# Altium schematic sheet DIOT_PSU_Mezzanine.SchDoc: DI/OT Crate
size 420 x 297 mm; Project: DI/OT Backplane - Front panel PCB; CheckedBy: G. Daniluk; Author: F. Świtakowski; CompanyName: Creotech Instruments SA; DrawnBy: F. Świtakowski; Organization: CERN; Address1: European Organization for Nuclear Research; Address2: CH-1211 Geneve 23 - Switzerland; DocumentNumber: 1; Revision: -; SheetNumber: 1; SheetTotal: 1; EDA_Number: EDA-04213-V3-0; Projet: DI/OT Crate; ModifiedBy: M. Fafara; CreateDate: 1.10.2019; CheckedDate: 10.11.2019; Title2: Front Interface; DivGrp: BE-CEM; Designer: F. Świtakowski; SPICEModelCacheTQWPXFHW: <root> / <DocumentId>TQWPXFHW</DocumentId> / </root>; DocumentName: AFPGA_power.SchDoc; ModifiedDate: -; Rule: PcbType=ProtelPcb
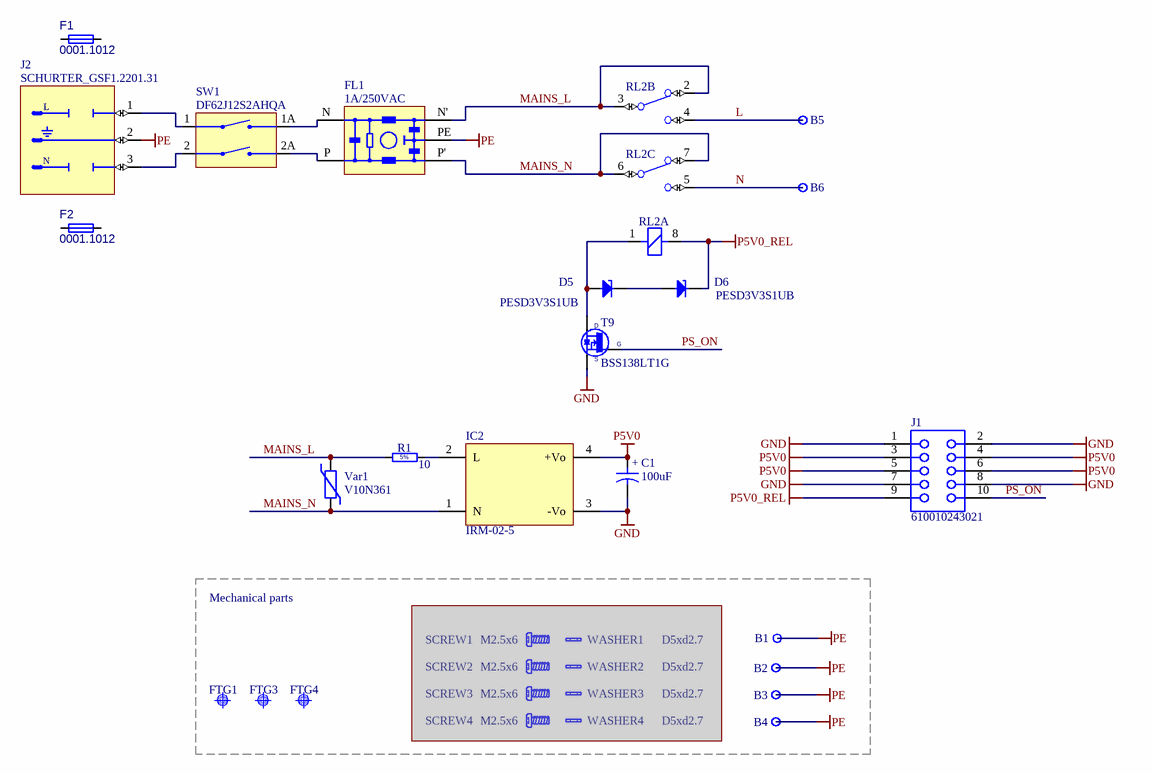
[diagram p0: DIOT_PSU_Mezzanine.SchDoc]

## Parts
B1  Plated Hole  [MTG320_550]  (value not drawn)  (no BOM)
B2  Plated Hole  [MTG320_550]  (value not drawn)  (no BOM)
B3  Plated Hole  [MTG320_550]  (value not drawn)  (no BOM)
B4  Plated Hole  [MTG320_550]  (value not drawn)  (no BOM)
B5  Plated Hole  [c350h200]  (value not drawn)  (no BOM)
B6  Plated Hole  [c350h200]  (value not drawn)  (no BOM)
C1  100uF  [CAPPR350-850X600]
D5  PESD3V3S1UB  [SODFL1608X65N]
D6  PESD3V3S1UB  [SODFL1608X65N]
F1  0001.1012  [0001.1012]
F2  0001.1012  [0001.1012]
FL1  1A/250VAC  [FIL_SCHAFFNER_FN 406]
FTG1  Use only in PCB  [FIDUCIAL_TOP_C100-200]  (value not drawn)  (no BOM)
FTG3  Use only in PCB  [FIDUCIAL_TOP_C100-200]  (value not drawn)  (no BOM)
FTG4  Use only in PCB  [FIDUCIAL_TOP_S100-200]  (value not drawn)  (no BOM)
IC2  IRM-02-5  [PWS_MEANWELL_IRM-02]
J1  610010243021  [610010243021]
J2  Part Number: SCHURTER_GSF1.2201.31  [SCHURTER_GSF1.2202.31]  (hidden comment: IEC)
R1  10  [RESADV508-1670X520]
RL2  REL_OMRON_G2RL-24  [REL_OMRON_G2RL-24]  (value not drawn)  (parts A,B,C of 3)
SCREW1  M2.5x6  [BOSSARD_BN5687-3061597_v]  (masked out: inside a compile mask, not in the netlist)
SCREW2  M2.5x6  [BOSSARD_BN5687-3061597_v]  (masked out: inside a compile mask, not in the netlist)
SCREW3  M2.5x6  [BOSSARD_BN5687-3061597_v]  (masked out: inside a compile mask, not in the netlist)
SCREW4  M2.5x6  [BOSSARD_BN5687-3061597_v]  (masked out: inside a compile mask, not in the netlist)
SW1  DF62J12S2AHQA  [DF62J12S2AHQA]
T9  BSS138LT1G  [SOT95P240X110-3N]
Var1  V10N361  [VARISTOR THT]
WASHER1  D5xd2.7  [BOSSARD_BN678-8303525_v]  (masked out: inside a compile mask, not in the netlist)
WASHER2  D5xd2.7  [BOSSARD_BN678-8303525_v]  (masked out: inside a compile mask, not in the netlist)
WASHER3  D5xd2.7  [BOSSARD_BN678-8303525_v]  (masked out: inside a compile mask, not in the netlist)
WASHER4  D5xd2.7  [BOSSARD_BN678-8303525_v]  (masked out: inside a compile mask, not in the netlist)

## Blocks framed on the sheet
Mechanical parts: B1-B4 FTG1 FTG3 FTG4 SCREW1-SCREW4 WASHER1-WASHER4

## Nets
GND: C1.2 IC2.3(-Vo) J1.1 J1.2 J1.7 J1.8 T9.2(S)
P5V0: C1.1 IC2.4(+Vo) J1.3 J1.4 J1.5 J1.6
P5V0_REL: D6.1(C) J1.9 RL2.8
PE: B1.1 B2.1 B3.1 B4.1 FL1.PE J2.2
L: B5.1 RL2.4(NO)
MAINS_L: FL1.N' R1.2 RL2.2(NC) RL2.3(C) Var1.2
MAINS_N: FL1.P' IC2.1(N) RL2.6(C) RL2.7(NC) Var1.1
N: B6.1 RL2.5(NO)
PS_ON: J1.10 T9.1(G)
NetD5_1: D5.1(C) D6.2(A)
NetD5_2: D5.2(A) RL2.1 T9.3(D)
NetFL1_N: FL1.N SW1.1A
NetFL1_P: FL1.P SW1.2A
NetIC2_2: IC2.2(L) R1.1
NetJ2_1: J2.1 SW1.1
NetJ2_3: J2.3 SW1.2

## Notes on the sheet
- Project/Equipment
- Document
- Designer
- Drawn by
- Check.by
- Copyright WUT ISE 2020.
  This documentation describes Open Hardware and is licensed under the CERN OHL v.1.2. You may redistribute and modify this documentation under the terms of the CERN OHL v.1.2. (http://ohwr.org/CERNOHL). This documentation is distributed WITHOUT ANY EXPRESS OR IMPLIED WARRANTY, INCLUDING OF MERCHANTABILITY, SATISFACTORY QUALITY AND FITNESS FOR A PARTICULAR PURPOSE. Please see the CERN OHL v.1.2 for applicable conditions.
- Contact
- File
- Last Mod.
- Print Date
- Sheet
- Size
- A3
- of
- Rev
- (in symbol CAER_100UF_10V_20%_350-850X600_LESR0R032) +
- (in symbol RMF_10R_5%_3W_250PPM_508-1670X520_v) 5%
- (in symbol SCHURTER_GSF1.2202.31) L; N

## Library data of the parts
B1-B4 = PLATED_HOLE3.2_PAD5.5: Single Terminal Socket; Part Description: Plated Through Hole: Hole Dia.=3.2mm Pad Dia.=5.5mm; Mounted: No; Part Number: PLATED_HOLE3.2_PAD5.5; Component Type: Standard (No BOM); Pin Count: 1; Family: Plated Hole; Socket: No; SMD: No; Sense: No; Status: None; ComponentHeight: 0mm; HelpURL: Undefined; Author: CERN DEM JMW; CreateDate: 01.10.2012; LatestRevisionDate: 01.10.2012; PackageDescription: Plated Through Hole: Hole Dia.=3.2mm Pad Dia.=5.5mm
B5 B6 = PLATED_HOLE2.0_PAD3.5: Single Terminal Socket; Part Description: Plated Through Hole: Hole Dia.=2.0mm Pad Dia.=3.5mm; Mounted: No; Part Number: PLATED_HOLE2.0_PAD3.5; Component Type: Standard (No BOM); Pin Count: 1; Family: Plated Hole; Socket: No; SMD: No; Sense: No; Status: None; ComponentHeight: 0mm; HelpURL: Undefined; Author: CERN DEM JMW; CreateDate: 05.11.2009; LatestRevisionDate: 05.11.2009; PackageDescription: Plated Through Hole: Hole Dia.=2.0mm Pad Dia.=3.5mm
C1 = CAER_100UF_10V_20%_350-850X600_LESR0R032: Polarised capacitor; Part Description: Low ESR 0R032 Aluminum Solid Capacitor with Organic Semiconductive Electrolyte; Manufacturer: SANYO OS-CON; Manufacturer Part Number: 10SP100M; Voltage: 10V; Tolerance: ±20%; Part Number: CAER_100UF_10V_20%_350-850X600_LESR0R032; Component Kind: Standard; Component Type: Standard; Pin Count: 2; Value: 100uF; Status: Obsolete; Case: LS3.5 D8.5 x H6; Mounted: Yes; Socket: No; SMD: No; Sense: No; ComponentHeight: 6mm; HelpURL: \\cern.ch\dfs\Applications\Altium\Datasheets\CAER-LESR_SANYO_SP.pdf; Author: CERN DEM JLC; CreateDate: 29.01.2008; LatestRevisionDate: 16.03.2009
D5 D6 = PESD3V3S1UB: ESD protection diode; Part Description: ESD protection diode (23kV); Manufacturer: NXP SEMICONDUCTORS; Voltage: 3V3; Power: 330W; PressFit: No; Bonding: No; Part Number: PESD3V3S1UB; Component Kind: Standard; Component Type: Standard; Device: PESD3V3S1UB; PackageDescription: Ultra Small Outline Diode Flat Lead (SOD-523), Body; 1.2mm L X 0.8mm W X 0.65mm H, IPC Medium Density; Manufacturer Part Number: PESD3V3S1UB; Pin Count: 2; Case: SOD523; Mounted: Yes; Socket: No; SMD: Yes; Sense: No; ComponentHeight: 0.65mm; HelpURL: \\cern.ch\dfs\Applications\Altium\Datasheets\PESD3V3S1UB.pdf; Author: CERN DEM JLC; CreateDate: 29.11.2012; LatestRevisionDate: 29.11.2012
F1 F2 = CMP-005-00401-1: Electric Fuse, Very Fast Blow, 6.3A, 250VAC, 1500A (IR), Inline/holder, 5x20mm; Mounting Technology: Holder; Current Rating: 6.3A; Max Operating Temperature: 125°C; Min Operating Temperature: -55°C; RoHS Compliant: Yes
FL1 = FIL_SCHAFFNER_FN 406-1-02: 0.6 to 8.4A 230VAC Single Phase Ultra Compact EMC Filter; Part Number: FIL_SCHAFFNER_FN406-3-02; Manufacturer Part Number: FN406-3-02; Component Kind: Standard; Component Type: Standard; Pin Count: 5; Value: 1A/250VAC; Part Description: Single Phase Ultra Compact EMC Filter; Manufacturer: SCHAFFNER; Case: L45 W15 H28; Mounted: Yes; Socket: No; SMD: No; Sense: No; ComponentHeight: 28mm; HelpURL: \\cern.ch\dfs\Applications\Altium\Datasheets\FIL_SCHAFFNER_FN 406-1-02.pdf; Author: CERN DEM JLC; CreateDate: 24.05.2017; LatestRevisionDate: 24.05.2017
FTG1 FTG3 = FIDUCIAL_TARGET_C100-200: Fiducial Target; Part Description: Round Fiducial Target, Top Layer, 1.0mm, Top Solder 2.0mm, Keepout =2.0mm; Mounted: No; Part Number: FIDUCIAL_TARGET_C100-200; Component Type: Standard (No BOM); Pin Count: 1; Family: Fiducial; Socket: No; SMD: Yes; Sense: No; Status: None; ComponentHeight: 0mm; HelpURL: Undefined; Author: CERN DEM JLC; CreateDate: 09.02.2010; LatestRevisionDate: 04.04.2012; PackageDescription: Round Fiducial Target, Top Layer, 1.0mm, Top Solder 2.0mm, Keepout =2.0mm
FTG4 = FIDUCIAL_TARGET_S100-200: Fiducial Target; Part Description: Square Fiducial Target, Top Layer, 1.0mm, Top Solder 2.0mm, Keepout =2.0mm; Mounted: No; Part Number: FIDUCIAL_TARGET_S100-200; Component Type: Standard (No BOM); Pin Count: 1; Family: Fiducial; Socket: No; SMD: Yes; Sense: No; Status: None; ComponentHeight: 0mm; HelpURL: Undefined; Author: CERN DEM JLC; CreateDate: 09.02.2010; LatestRevisionDate: 04.04.2012; PackageDescription: Square Fiducial Target, Top Layer, 1.0mm, Top Solder 2.0mm, Keepout =2.0mm
IC2 = AC_DC_IRM-02-5: Power Supply; Part Description: 85-305VAC to 5VDC (400mA) 2W Power Supply; Manufacturer: MEAN WELL; PressFit: No; Bonding: No; Part Number: IRM-02-5; Component Kind: Standard; Component Type: Standard; Device: IRM-02-5; PackageDescription: IRM-02 Series, Body 33.7x22.2mm, Power Supply; Status: None; Manufacturer Part Number: IRM-02-5; Pin Count: 4; Mounted: Yes; Socket: No; SMD: No; Sense: No; ComponentHeight: 15mm; HelpURL: \\cern.ch\dfs\Applications\Altium\Datasheets\IRM-02-24.pdf; Author: GK; CreateDate: 14.02.2018; LatestRevisionDate: 14.02.2018
J1 = 610010243021: WR-PHD Socket Header, SMT, Vertical, pitch 2.54mm, 2 Row, 10P; Manufacturer: Wurth Elektronik; Contact Resistance: 20mOhm; Rated Current: 3A; Working Voltage: 250V; Withstanding Voltage: 500V; Manufacturer Part Number: 610010243021; Category: Board-to-Board Connectors; Match Code: WR-PHD; ComponentLink1Description: Website Link; ComponentLink1URL: https://www.we-online.com/redexpert/article/610010243021?ad; ComponentLink2Description: Datasheet Link; ComponentLink2URL: https://www.we-online.com/redexpert/spec/610010243021?ad; Mount: Surface Mount; Operating Temperature Max: 125°C; Operating Temperature Min: -40°C; Packaging: Tube; Gender: Socket Header; Number of Pins: 10; Number of Rows: 2; Orientation: Vertical; Pitch: 2.54mm
J2 = SCHURTER_GSF1.2202.31: Connector 3 Male 2P+ 2 Fuse Holder; Part Description: 10A 250Vac Sandwich Panel Mount (1.5mm) Inlet IEC Connector With 2 Fuseholder 5x20mm And Snap-in PCB Mount; Manufacturer Part Number: GSF1.2201.31; PressFit: No; Component Kind: Standard; Component Type: Standard; Footprint: SCHURTER_GSF1.2201.31; Pin Count: 3; Family: IEC; Mounted: Yes; Socket: No; SMD: No; Sense: No; Status: None; Manufacturer: SCHURTER; ComponentHeight: 24.45mm; HelpURL: \\cern.ch\dfs\Applications\Altium\Datasheets\SCHURTER_GSF1.2202.31.pdf; Author: CERN DEM JMW; CreateDate: 20.09.2012; LatestRevisionDate: 20.09.2012
R1 = RMF_10R_5%_3W_250PPM_508-1670X520_v: Resistor - 5%; Part Description: Leaded Power Metal Film Resistor (Vertical Mount) PR03 Series; Manufacturer: GENERIC; Manufacturer1 Part Number: PR03000201009JAC00; Power: 3W; TC: ±250ppm/°C; PressFit: No; Part Number: RMF_10R_5%_3W_250PPM_508-1670X520_v; Component Kind: Standard; Component Type: Standard; Pin Count: 2; Value: 10; Status: Preferred; Tolerance: ±5%; Manufacturer Part Number: RMF_10R_5%_3W_250PPM_508-1670X520; Case: LS5.08 L16.7 x D5.2; Mounted: Yes; Sense: No; Socket: No; SMD: No; ComponentHeight: 23.6mm; Manufacturer1 Example: VISHAY BCCOMPONENT; Manufacturer1 ComponentHeight: 23.6mm; HelpURL: \\cern.ch\dfs\Applications\Altium\Datasheets\RMF_VISHAY_PR03.pdf; Author: CERN DEM JLC; CreateDate: 04.07.2017; LatestRevisionDate: 04.07.2017
RL2 = REL_OMRON_G2RL-24-DC5: DPDT Power Relay, G2RL Series; Part Description: 8A@250VAC, DPDT Power Relay, G2RL Series; Manufacturer: OMRON ELECTRONIC; PressFit: No; Sense Comment: Sensitive=No (Component Sealed); Value: 5VDC; Part Number: REL_OMRON_G2RL-24-DC5; Component Kind: Standard; Component Type: Standard; Pin Count: 8; PackageDescription: 8 Leads, Row Spacing 7.5mm; Body 29mm x 12.7mm, OMRON_G2RL Series; Mounted: Yes; Socket: No; SMD: No; Sense: No; Status: None; Manufacturer Part Number: G2RL-24-DC5; ComponentHeight: 15.7mm; HelpURL: \\cern.ch\dfs\Applications\Altium\Datasheets\REL_OMRON_G2RL-24.pdf; Author: CERN DEM BC; CreateDate: 11.09.2023; LatestRevisionDate: 11.09.2023
SCREW1-SCREW4 = BOSSARD_BN5687-3061597_v: Screw; Part Description: M2.5 L=6mm Hexalobular Socket Pan Head Screw, Fully Threaded, Stainless Steel A2; Manufacturer Part Number: BN5687 Art.3061597; PressFit: No; Part Number: BOSSARD_BN5687-3061597_v; Component Kind: Standard; Component Type: Mechanical; Pin Count: 0; PackageDescription: M2.5 L=6mm Hexalobular Socket Pan Head Screw, Fully Threaded - Stainless Steel A2; Mounted: Yes; Socket: No; SMD: No; Sense: No; Status: None; Value: M2.5x6; Manufacturer: BOSSARD; ComponentHeight: 2.1mm; HelpURL: \\cern.ch\dfs\Applications\Altium\Datasheets\BOSSARD_BN5687-3061597.pdf; Author: CERN DEM JLC; CreateDate: 30.05.2013; LatestRevisionDate: 30.05.2013
SW1 = DF62J12S2AHQA: Rocker Switch DPST 16A (AC), 6A (DC) 125 V Panel Mount, Snap-In, Right Angle; Manufacturer: C&K; Tolerance: ±1%; PressFit: No; Part Number: DF62J12S2AHQA; Component Kind: Standard; Component Type: Standard; Pin Count: 6; Status: None; Part Description: Rocker Switch DPST 16A (AC), 6A (DC) 125 V Panel Mount, Snap-In, Right Angle; Manufacturer Part Number: DF62J12S2AHQA; Mounted: Yes; Sense: No; Socket: No; SMD: No; ComponentHeight: 12mm; HelpURL: https://www.ckswitches.com/media/1443/df.pdf; Author: LPA; CreateDate: 9.03.2025; LatestRevisionDate: 9.03.2025
T9 = BSS138LT1G: N-CHANNEL MOSFET WITH DIODE; Part Description: 50V, 200mA N-Channel Enhancement Mode Field-Effect Transistor; Manufacturer: ON SEMICONDUCTOR; PressFit: No; Bonding: No; Part Number: BSS138LT1G; Component Kind: Standard; Component Type: Standard; Device: BSS138LT1G; PackageDescription: SOT23, 0.95mm Pitch; 3 Pin, 1.40mm W X 3.00mm L X 1.10mm H body, IPC Medium Density; Manufacturer Part Number: BSS138L; Pin Count: 3; Case: SOT23-3; Mounted: Yes; Socket: No; SMD: Yes; Sense: No; ComponentHeight: 1.11mm; HelpURL: \\cern.ch\dfs\Applications\Altium\Datasheets\BSS138LT1G.pdf; Author: CERN DEM JLC; CreateDate: 23.03.2009; LatestRevisionDate: 25.05.2022
Var1 = V10N361: Warystor fi10mm 360V; Manufacture: LS-TECH; DafaultFootprint: THT Varistor fi10mm; Assembly: THT; Parameter1: Umax; Parameter2: Imax; Value2: 3.6kA; Shop1: Maritex; Replacement1: ERZE10A361; ComponentLink1URL: https://www.maritex.com.pl/elementy_pasywne/warystory/warystory_tht/warystory_tht/v10n361.html; ComponentLink2URL: *; ComponentLink1Description: Datasheet; ComponentLink2Description: *; Value1: 360V; Shop1ID: V10N361; ComponentType: Varistor; ComponentSymbol: V10N361; Tolerance1: *
WASHER1-WASHER4 = BOSSARD_BN678-8303525_v: Washer; Part Description: Waved Spring Washer for M2.5 Screw, Stainless Steel A2 / 1.4310; Manufacturer Part Number: BN678 Art.8303525; PressFit: No; Status Comment: Replaced by BOSSARD_BN83728-8051127_v; Part Number: BOSSARD_BN678-8303525_v; Component Kind: Standard; Component Type: Mechanical; Pin Count: 0; PackageDescription: Waved Spring Washer for M2.5 Screw, Stainless Steel A2 / 1.4310; Mounted: Yes; Socket: No; SMD: No; Sense: No; Status: Obsolete; Value: D5xd2.7; Manufacturer: BOSSARD; ComponentHeight: 0.3mm; HelpURL: \\cern.ch\dfs\Applications\Altium\Datasheets\BOSSARD_BN678-8303525.pdf; Author: CERN DEM JLC; CreateDate: 22.10.2012; LatestRevisionDate: 15.01.2013